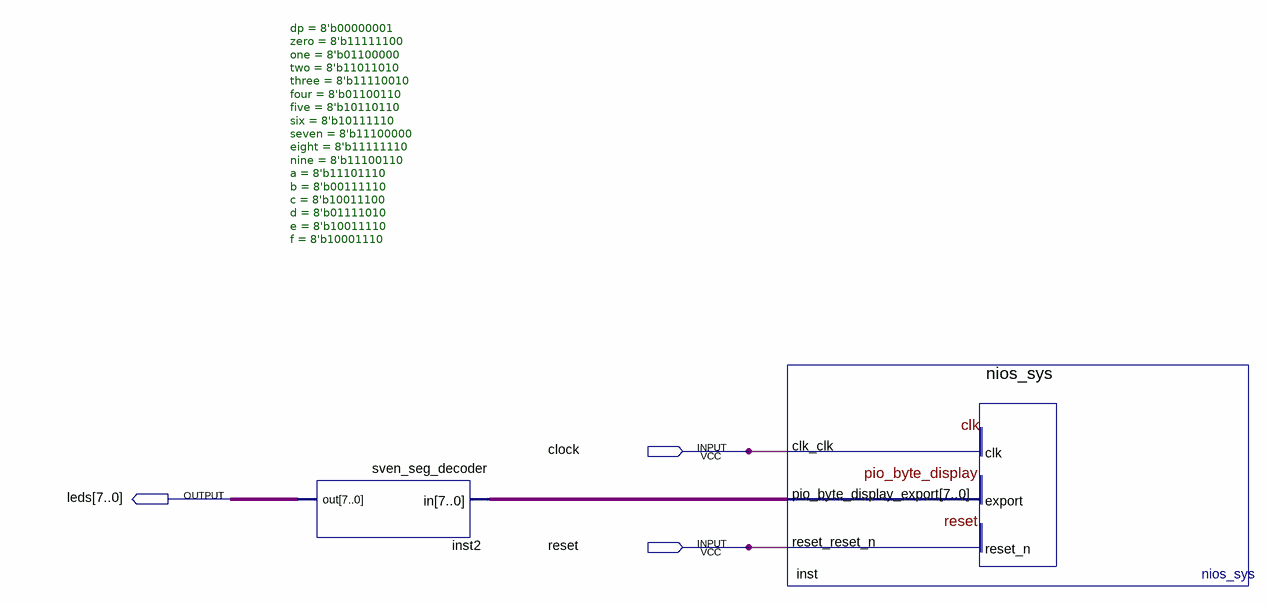
[diagram p0: schematic sheet]
// Quartus schematic seven_segment.bdf as structural Verilog: 2 symbols, 3 pins
module seven_segment (
  input  clock,
  input  reset,
  output [7:0] leds
);

  wire [7:0] inst_pio_byte_display_export;

  sven_seg_decoder #(.dp(8'b00000001), .zero(8'b11111100), .one(8'b01100000), .two(8'b11011010), .three(8'b11110010), .four(8'b01100110), .five(8'b10110110), .six(8'b10111110), .seven(8'b11100000), .eight(8'b11111110), .nine(8'b11100110), .a(8'b11101110), .b(8'b00111110), .c(8'b10011100), .d(8'b01111010), .e(8'b10011110), .f(8'b10001110)) inst2 (
    .in(inst_pio_byte_display_export), .out(leds));
  nios_sys inst (.clk_clk(clock), .reset_reset_n(reset), .pio_byte_display_export(inst_pio_byte_display_export));
endmodule
